# EAGLE design v0.1.0 (EAGLE 9.2.0)

## Sheet 1 of 2
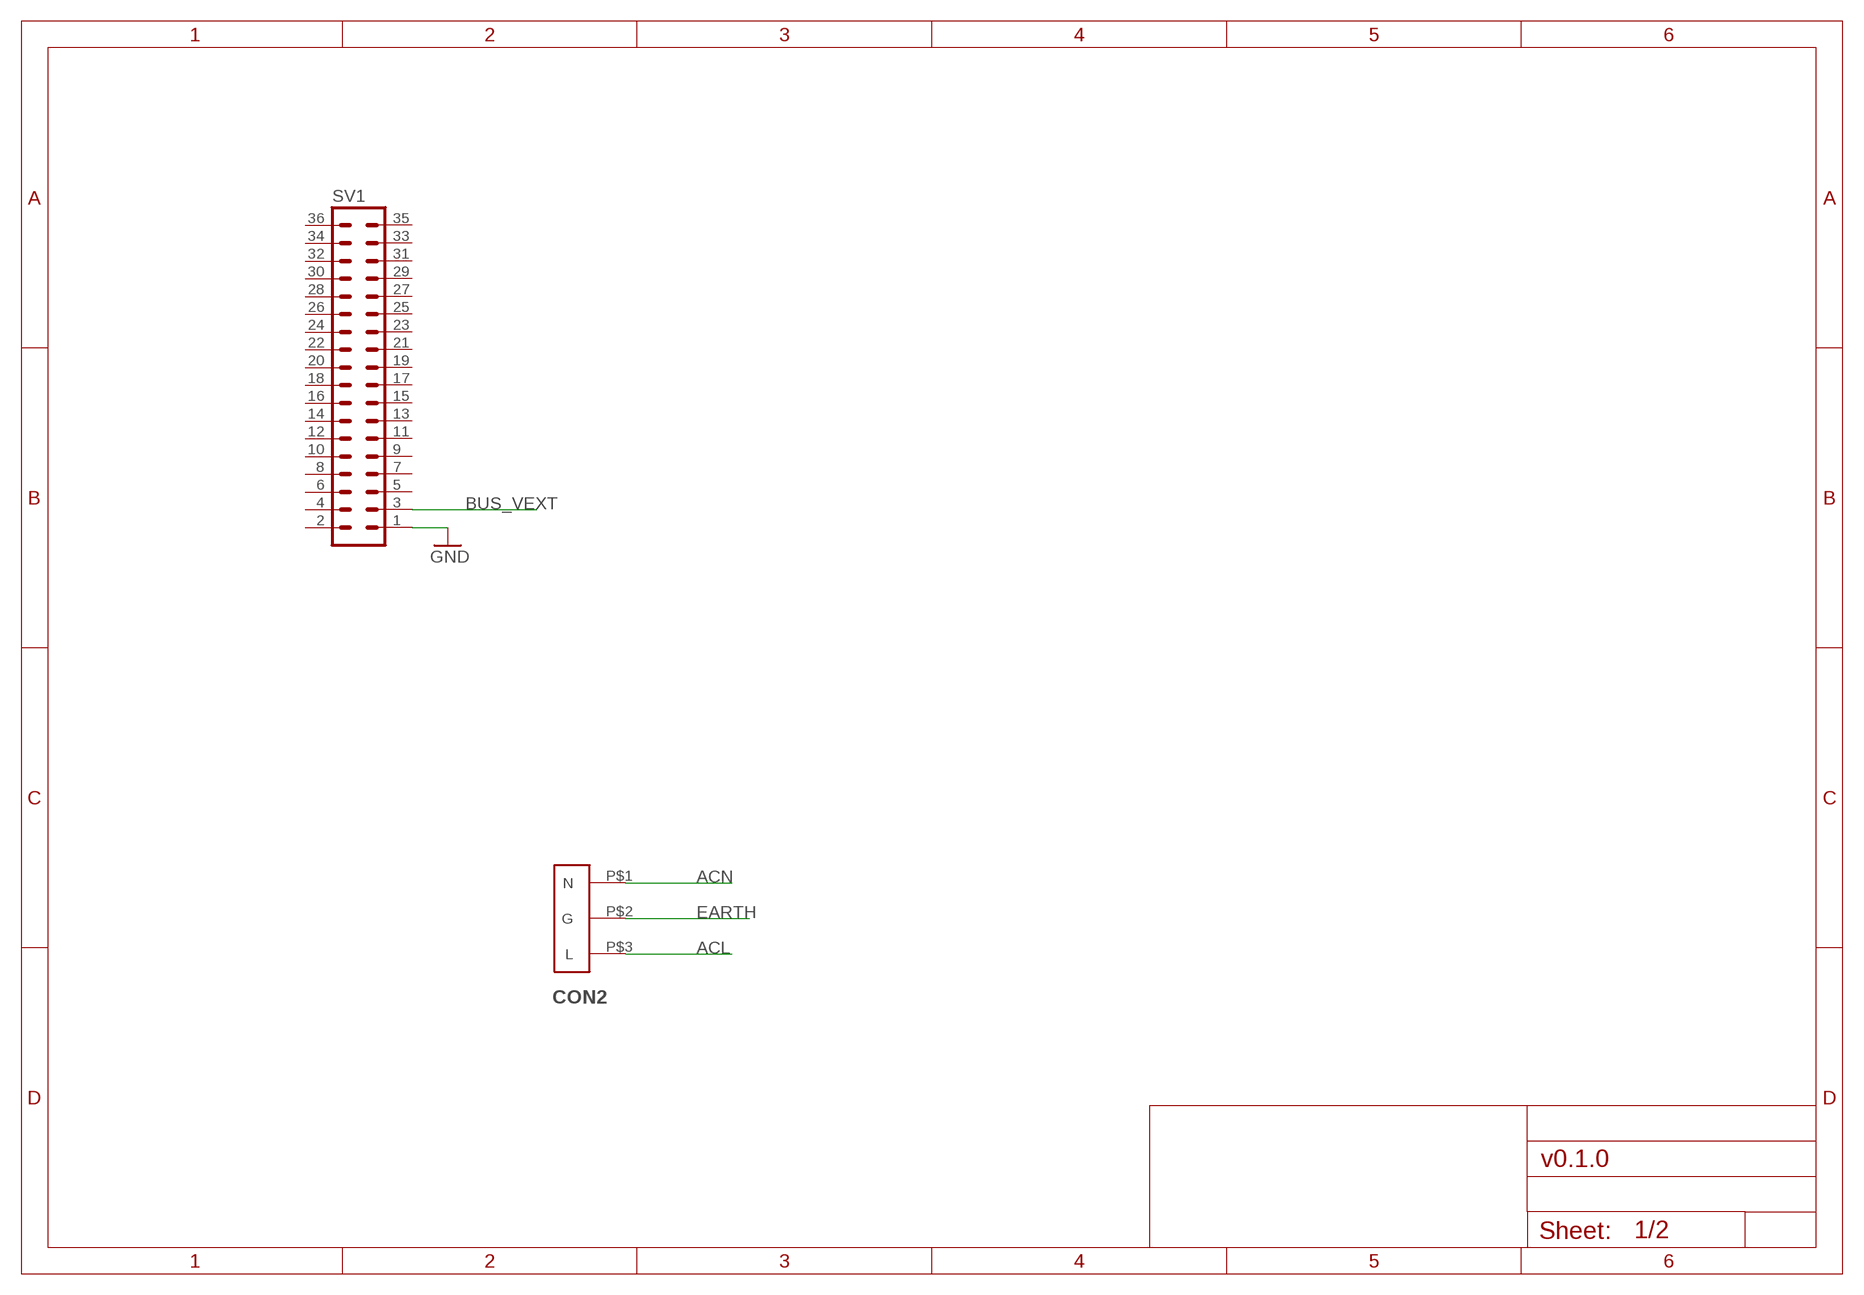
[diagram p0: schematic, sheet 1]

### Parts
CON2  4300.0101  [IEC-C6]
SV1  MA18-2  [MA18-2]

### Nets
ACL: CON2.P$3(L) ; also sheet 2
ACN: CON2.P$1(N) ; also sheet 2
BUS_VEXT: SV1.3 ; also sheet 2
EARTH: CON2.P$2(G) ; also sheet 2
GND: SV1.1 ; also sheet 2
Unconnected: SV1.2 SV1.4 SV1.5 SV1.6 SV1.7 SV1.8 SV1.9 SV1.10 SV1.11 SV1.12 SV1.13 SV1.14 SV1.15 SV1.16 SV1.17 SV1.18 SV1.19 SV1.20 SV1.21 SV1.22 SV1.23 SV1.24 SV1.25 SV1.26 SV1.27 SV1.28 SV1.29 SV1.30 SV1.31 SV1.32 SV1.33 SV1.34 SV1.35 SV1.36

## Sheet 2 of 2
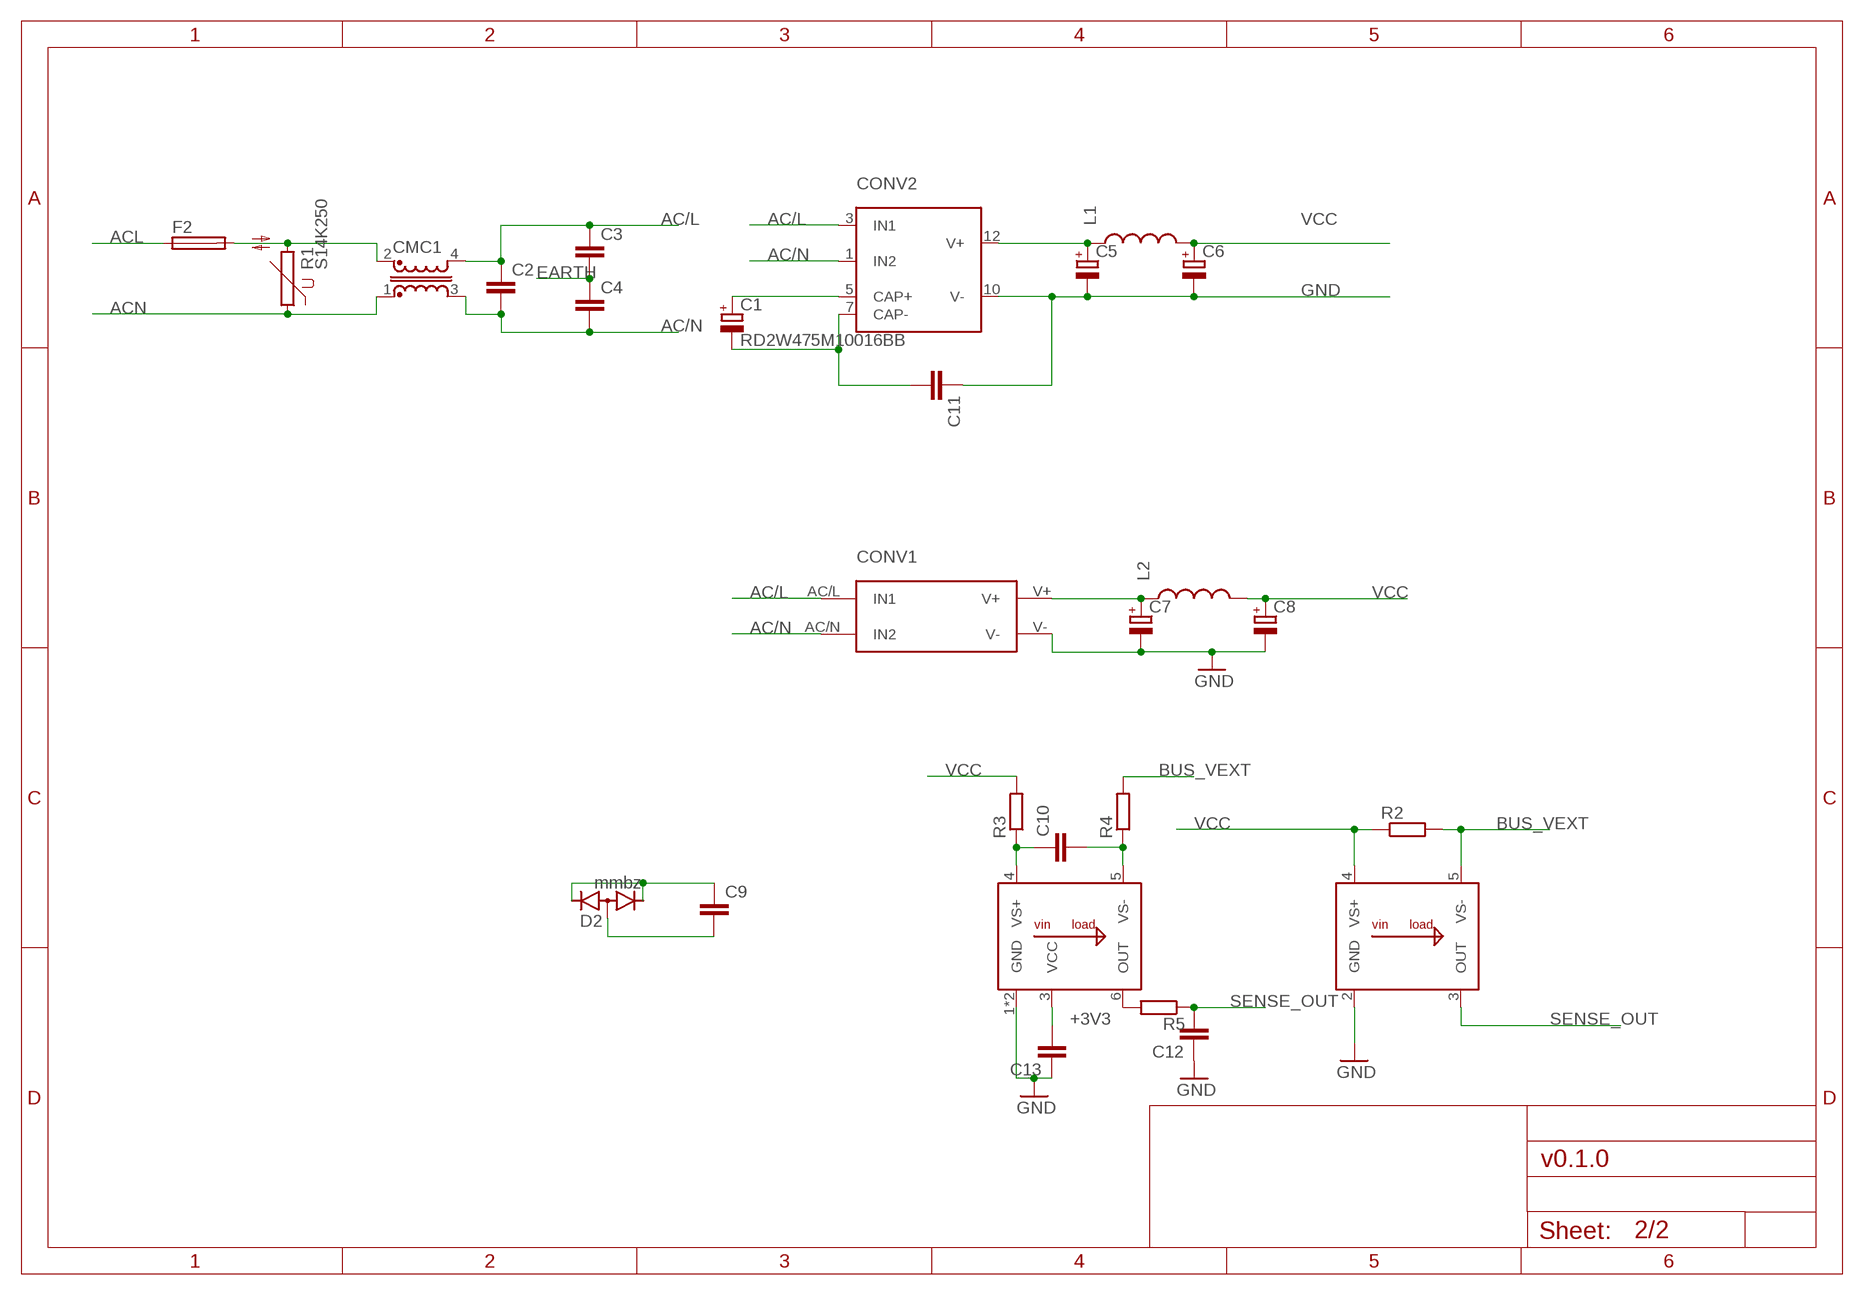
[diagram p1: schematic, sheet 2]

### Parts
C1  RD2W475M10016BB  CPOL-EUE5-10.5  [E5-10,5]
C2  C-EUC1206  [C1206]
C3  C-EUC1206  [C1206]
C4  C-EUC1206  [C1206]
C5  CPOL-EUE5-10.5  [E5-10,5]
C6  CPOL-EUE5-10.5  [E5-10,5]
C7  CPOL-EUE5-10.5  [E5-10,5]
C8  CPOL-EUE5-10.5  [E5-10,5]
C9  C-EUC1206  [C1206]
C10  C-EUC0402  [C0402]
C11  C-EUC1206  [C1206]
C12  C-EUC0402  [C0402]
C13  C-EUC0402  [C0402]
CMC1  DLD-302U-1A  [DLD]
CONV1  IRM-03-12V  [IRM-03]
CONV2  AMEOF312SJZ  [AMEOF3-JZ]
D2  mmbz  DIODE-2CA|ACSOT23  [SOT23]
F2  ZH8  [ZH8X2]
IC1  ZXCT1021  [SOT95P240X110-5]
IC2  BQ500100  [SC70-6]
L1  COIL0608-0.022  [COIL0608]
L2  COIL0608-0.022  [COIL0608]
R1  S14K250  [S14K250]
R2  R-EU_R0805  [R0805]
R3  R-EU_R0402  [R0402]
R4  R-EU_R0402  [R0402]
R5  R-EU_R0402  [R0402]

### Nets
+3V3: C13.2 IC2.3(VCC)
AC/L: C2.1 C3.1 CMC1.4 CONV1.AC/L(IN1) CONV2.3(IN1)
AC/N: C2.2 C4.2 CMC1.3 CONV1.AC/N(IN2) CONV2.1(IN2)
ACL: F2.1 F2.1A ; also sheet 1
ACN: CMC1.1 R1.1 ; also sheet 1
BUS_VEXT: IC1.5(VS-) R2.2 R4.2 ; also sheet 1
EARTH: C3.2 C4.1 ; also sheet 1
GND: C5.- C6.- C7.- C8.- C11.1 C12.1 C13.1 CONV1.V- CONV2.10(V-) IC1.2(GND) IC2.1(GND) IC2.2(GND) ; also sheet 1
N$1: C1.+ CONV2.5(CAP+)
N$2: C1.- C11.2 CONV2.7(CAP-)
N$3: C5.+ CONV2.12(V+) L1.P$1
N$4: CMC1.2 F2.2 F2.2A R1.2
N$6: C7.+ CONV1.V+ L2.P$1
N$7: C9.1 D2.1(K1) D2.2(K2)
N$9: C9.2 D2.3(A)
N$11: IC2.6(OUT) R5.2
N$16: C10.1 IC2.4(VS+) R3.1
N$17: C10.2 IC2.5(VS-) R4.1
SENSE_OUT: C12.2 IC1.3(OUT) R5.1
VCC: C6.+ C8.+ IC1.4(VS+) L1.P$2 L2.P$2 R2.1 R3.2

## Library data of the parts
C1 C5-C8 = rcl:CPOL-EU: POLARIZED CAPACITOR, European symbol; SPICEPREFIX: C
C2-C4 C9-C13 = rcl:C-EU: CAPACITOR, European symbol; SPICEPREFIX: C
CMC1 = parts-ferrocore:DLD-
CON2 = parts-schurter:4300.0101
CONV1 = parts-meanwell:IRM-
CONV2 = parts-aimtec:AMEOF3
D2 = diode:DIODE-2CA|AC: Dual DIODE Cathode-Anode|Anode-Cathode
F2 = parts-profuse:ZH8: there are two zh8 holders used
IC1 = parts-diodes:ZXCT1021
IC2 = parts-ti:BQ500100
L1 L2 = parts-ferrocore:COIL0608-
R1 = varistor:S14K250: VARISTOR
R2-R5 = rcl:R-EU_: RESISTOR, European symbol; SPICEPREFIX: R
SV1 = con-lstb:MA18-2: PIN HEADER; OC_FARNELL: unknown; OC_NEWARK: unknown

## Board
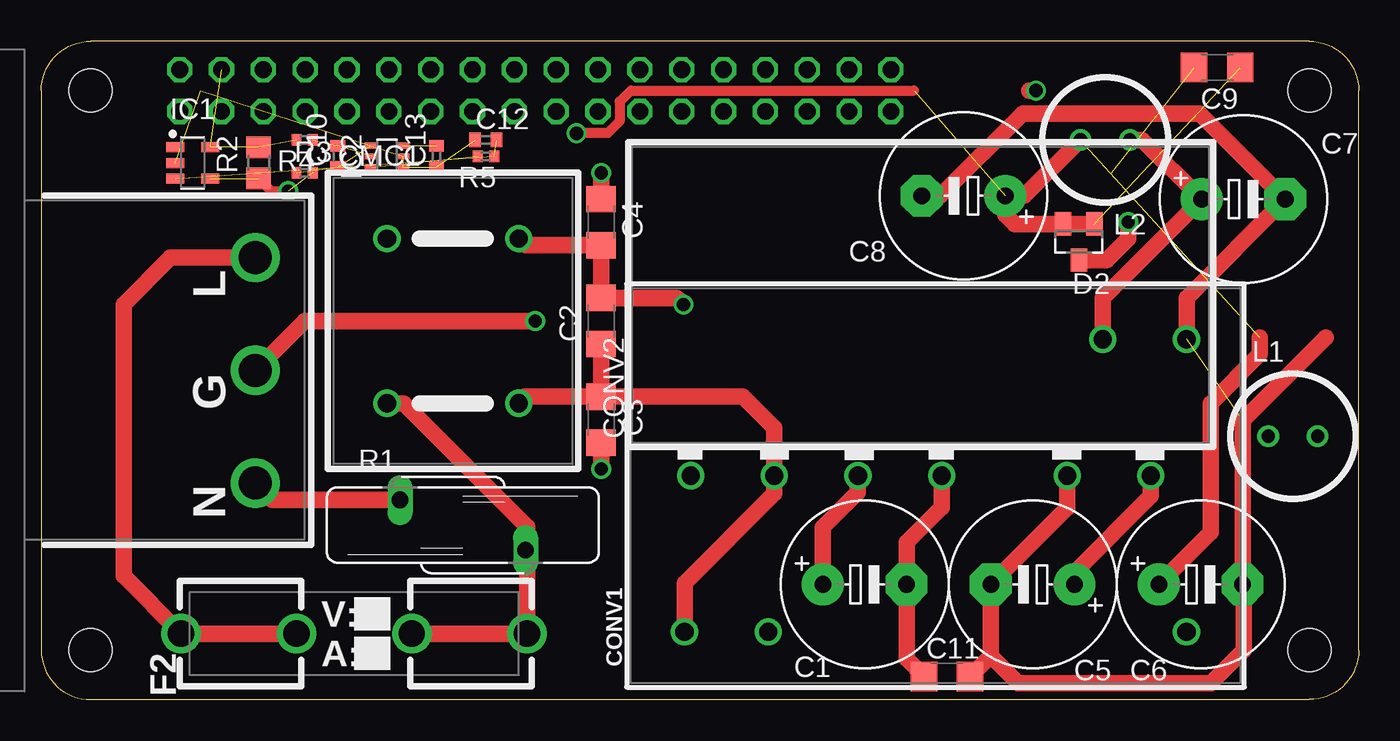
[diagram p2: board, top side]
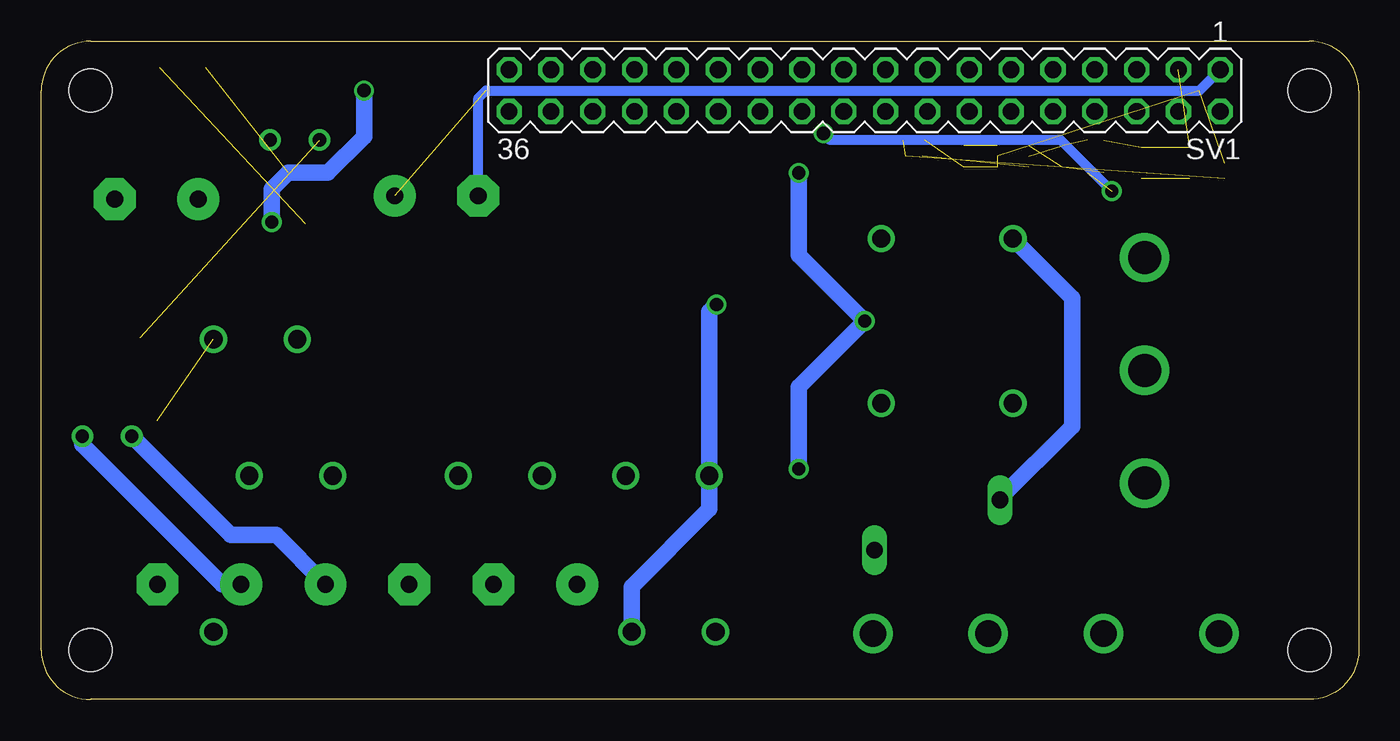
[diagram p3: board, bottom side, seen from below]

Size 80 x 40 mm. Coordinates in mm from the lower left corner, seen from the top.
Outline: 3,0 77,0 arc90 80,3 80,37 arc90 77,40 3,40 arc90 0,37 0,3 arc90 3,0
Copper layers (1*16): Top 0.035mm / dielectric 1.5mm / Bottom 0.035mm
Design rules "default *": minimum track width 6mil, minimum drill 0.35mm, track to track 6mil, track to pad 6mil, pad to pad 6mil, via to via 6mil, smd to smd 6mil, copper to edge 0.4mm, drill to drill 6mil, minimum pad ring 10mil, minimum via ring 8mil, stop-mask expansion 4mil, vias tented up to drill 0mil, thermal gap 10mil
Holes 2.6 mm at 3,3 3,37 77,37 77,3
bKeepout: area 0.5,0.5 to 5.5,5.5; area 0.5,34.5 to 5.5,39.5; area 74.5,34.5 to 79.5,39.5; area 74.5,0.5 to 79.5,5.5
tRestrict: area 0.5,0.5 to 5.5,5.5; area 0.5,34.5 to 5.5,39.5; area 74.5,34.5 to 79.5,39.5; area 74.5,0.5 to 79.5,5.5

### Footprints (pad centres in the part's own frame; a part is rotated, then mirrored left to right if it is on the bottom)
E5-10,5 = drill 1.016 pad 2.54: + -2.54,0 | drill 1.016 pad 2.54 octagon: - 2.54,0
C1206 = smd 1.6 x 1.8: 1 -1.4,0; 2 1.4,0
C0402 = smd 0.7 x 0.9: 1 -0.65,0; 2 0.65,0
DLD = drill 1.1: 1 -5,-4; 2 5,-4; 3 -5,4; 4 5,4
IEC-C6 = drill 2: P$1 -6.85,0; P$2 0,0; P$3 6.85,0
IRM-03 = drill 1.1: AC/L -15.24,-8.89; AC/N -10.16,-8.89; NC 15.24,-8.89; V+ 10.16,8.89; V- 15.24,8.89
AMEOF3-JZ = drill 1.1: 1 -13.97,-11; 3 -8.89,-11; 5 -3.81,-11; 7 1.27,-11; 10 8.89,-11; 12 13.97,-11
SOT23 = smd 1 x 1.4: 1 -0.95,-1.1; 2 0.95,-1.1; 3 0,1.1
ZH8X2 = drill 1.6: 1 -10.5,0; 1A -3.5,0; 2 3.5,0; 2A 10.5,0
SOT95P240X110-5 = smd 1.103 x 0.609: 1 -1.063,0.95; 2 -1.063,0; 3 -1.063,-0.95; 4 1.063,-0.95; 5 1.063,0.95
SC70-6 = smd 0.35 x 0.8: 1 -0.65,-0.95; 2 0,-0.95; 3 0.65,-0.95; 4 0.65,0.95; 5 0,0.95; 6 -0.65,0.95
COIL0608 = drill 0.8: P$1 -1.5,0; P$2 1.5,0
S14K250 = drill 1.016 long: 1 -1.524,-3.81; 2 1.524,3.81
R0805 = smd 1.3 x 1.5: 1 -0.95,0; 2 0.95,0
R0402 = smd 0.6 x 0.7: 1 -0.5,0; 2 0.5,0
MA18-2 = drill 1.016 octagon: 1 -21.59,-1.27; 2 -21.59,1.27; 3 -19.05,-1.27; 4 -19.05,1.27; 5 -16.51,-1.27; 6 -16.51,1.27; 7 -13.97,-1.27; 8 -13.97,1.27; 9 -11.43,-1.27; 10 -11.43,1.27; 11 -8.89,-1.27; 12 -8.89,1.27; 13 -6.35,-1.27; 14 -6.35,1.27; 15 -3.81,-1.27; 16 -3.81,1.27; 17 -1.27,-1.27; 18 -1.27,1.27; 19 1.27,-1.27; 20 1.27,1.27; 21 3.81,-1.27; 22 3.81,1.27; 23 6.35,-1.27; 24 6.35,1.27; 25 8.89,-1.27; 26 8.89,1.27; 27 11.43,-1.27; 28 11.43,1.27; 29 13.97,-1.27; 30 13.97,1.27; 31 16.51,-1.27; 32 16.51,1.27; 33 19.05,-1.27; 34 19.05,1.27; 35 21.59,-1.27; 36 21.59,1.27

### Placement (x,y rotation side)
C1  50,7 0 top
C2  34,23 90 top
C3  34,17 270 top
C4  34,29 270 top
C5  60.2,7 180 top
C6  70.4,7 0 top
C7  73,30.4 0 top
C8  56,30.6 180 top
C9  71.4,38.4 180 top
C10  18,33 90 top
C11  55,1.4 180 top
C12  27,34 0 top
C13  24,33 90 top
CMC1  25,23 270 top
CON2  13,20 90 top
CONV1  54.3,13 0 top
CONV2  53.4,24.6 0 top
D2  63,27.8 180 top
F2  19,4 0 top
IC1  9.2,32.6 0 top
IC2  21,33 90 top
L1  76,16 0 top
L2  64.6,34 180 top
R1  25.6,10.6 270 top
R2  13.2,32.6 90 top
R3  16,32 0 top
R4  16,34 180 top
R5  27,33 180 top
SV1  30,37 180 bottom

### Tracks (layer width: path | path; a pad name or v marks a point on that pad's centre or on a via)
+3V3  (1 unrouted)
AC/L
  Top 1: CMC1.4 29.4,18.4 C3.1 | C2.1 C3.1 | C3.1 42.6,18.4 44.51,16.49 CONV2.3 44.51,12.51 39.06,7.06 CONV1.AC/L
AC/N  (via drill 0.8)
  Top 1: CMC1.3 29.4,27.6 C4.2 C2.2 38.6,24.4 v39,24
  Bottom 1: v39,24 39.43,23.57 CONV2.1 39.43,11.57 44.14,6.86 CONV1.AC/N
ACL
  Top 1: CON2.P$3 7.85,26.85 5,24 5,7.5 F2.1 F2.1A
ACN
  Top 1: CON2.P$1 14.03,12.12 R1.1
  Bottom 1: CMC1.1 17.4,24.4 17.4,16.6 21.79,12.21 R1.1
BUS_VEXT  (3 unrouted)
EARTH  (via drill 0.8)
  Top 1: CON2.P$2 16,23 v30,23 | v34,14 C3.2 | v34,32 C4.1
  Bottom 1: v34,14 34,19 v30,23 34,27 v34,32
GND  (6 unrouted)
  Top 1: C11.1 57.66,2.66 | 57.66,2.66 C5.- 62.29,11.63 CONV2.10 | 57.66,2.66 59.32,1 71,1 73,3 73,6.94 C6.- 72.94,16.94 78,22 | CONV1.V- 69.54,24.4 C7.- 70.34,35.6 59.6,35.6 54.6,30.6 C8.-
  Bottom 0.6: SV1.1 9.68,37 53,37 53.46,36.54 C8.-
N$1
  Top 1: CONV2.5 49.59,12.59 47.46,10.46 C1.+
N$2
  Top 1: CONV2.7 54.67,11.67 52.54,9.54 C1.- 52.54,2.46 C11.2
N$3
  Top 1: CONV2.12 67.37,12.37 62.74,7.74 C5.+
  Bottom 1: C5.+ 65.74,10 68.5,10 L1.P$1
N$4
  Top 1: F2.2 F2.2A 29.5,8.99 | 29.5,8.99 R1.2 | CMC1.2 22,18 29.5,10.5 29.5,8.99
N$6
  Top 1: CONV1.V+ 64.46,24.4 C7.+ 66.86,34 L2.P$1
N$7  (1 unrouted)
  Top 1: 58.54,29.46 59.1,28.9 D2.2 D2.1
N$9  (via drill 0.8)  (1 unrouted)
  Top 1: D2.3 64.7,26.7 66,28 v66,29 | v60.4,37 60,37
  Bottom 1: v66,29 66,31 65,32 62.6,32 60.4,34.2 v60.4,37
N$11  (1 unrouted)
N$16  (2 unrouted)
N$17  (2 unrouted)
SENSE_OUT  (2 unrouted)
VCC  (via drill 0.8)  (4 unrouted)
  Top 0.6: R2.1 13.96,30.89 v15,30.89 | v32.5,34.4 32.52,34.42 34.41,34.42 35.12,35.13 35.12,36.32 35.8,37 53,37
  Top 1: C6.+ 71,10.14 71,18 74,21 74,22 | C8.+ 59.7,30.6 L2.P$2
  Bottom 0.6: v15,30.89 18.11,34 32.1,34 v32.5,34.4
  Bottom 1: C6.+ 69,7 77.5,15.5 L1.P$2